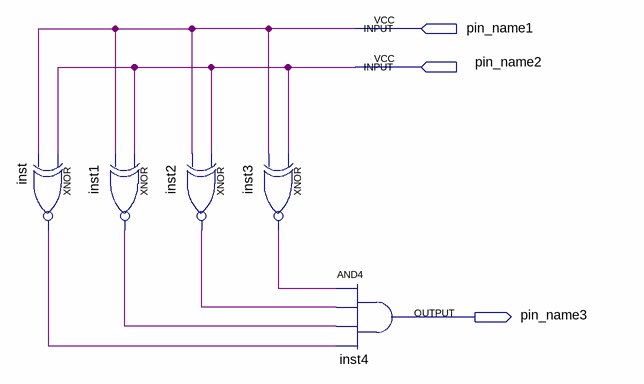
[diagram p0: schematic sheet]
// Quartus schematic EqCmp4.bdf as structural Verilog: 5 symbols, 3 pins
module EqCmp4 (
  input  pin_name1,
  input  pin_name2,
  output pin_name3
);

  wire inst1_out, inst2_out, inst3_out, inst_out;

  xnor inst (inst_out, pin_name2, pin_name1);
  xnor inst1 (inst1_out, pin_name2, pin_name1);
  xnor inst2 (inst2_out, pin_name2, pin_name1);
  xnor inst3 (inst3_out, pin_name2, pin_name1);
  and inst4 (pin_name3, inst3_out, inst2_out, inst1_out, inst_out);
endmodule
